# EAGLE design basic (EAGLE 7.5.0)
Luminous Flower Controller
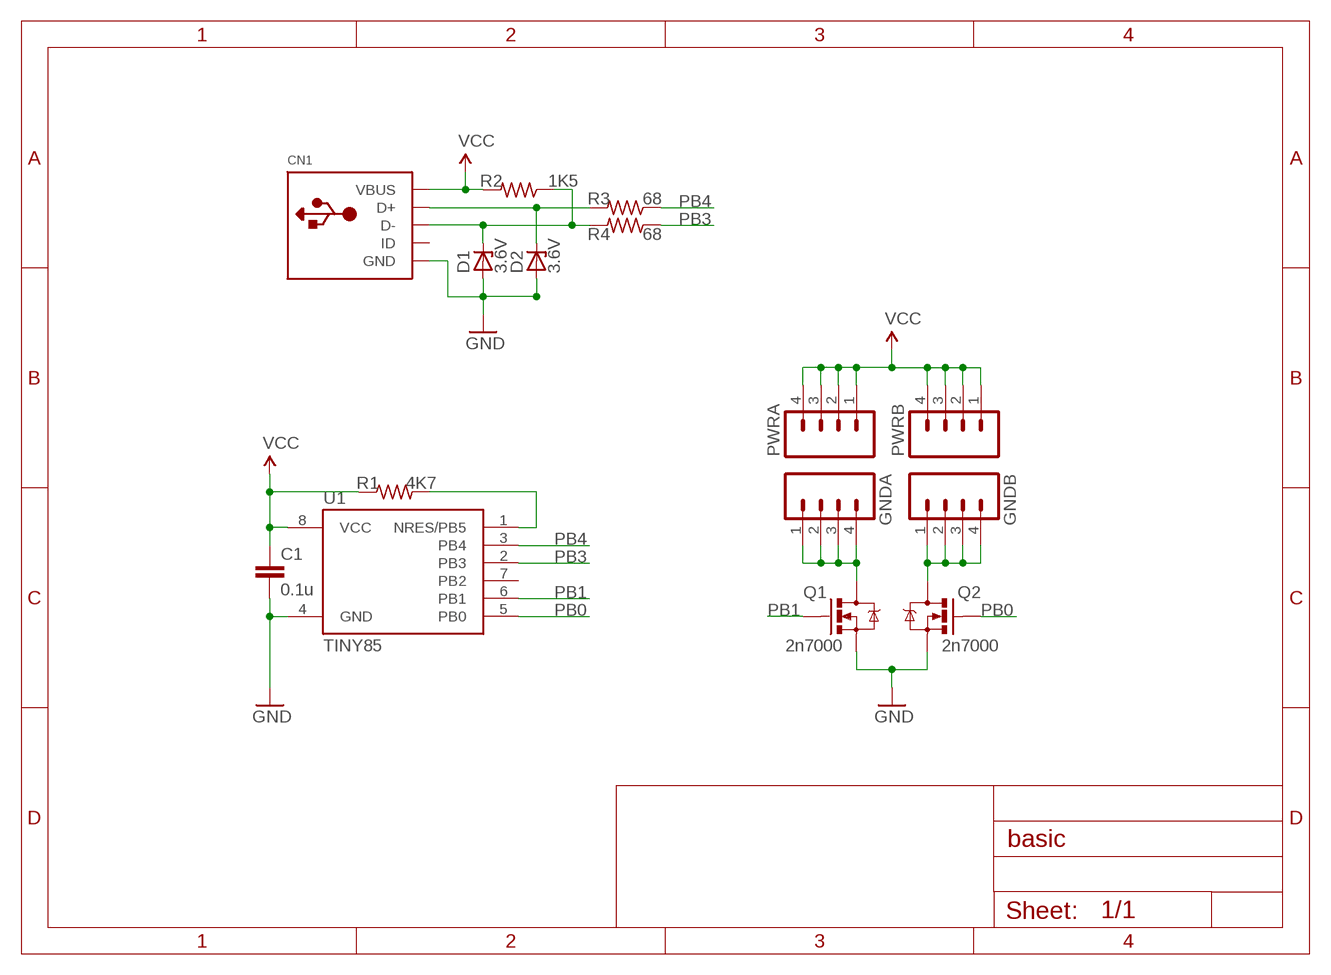
[diagram p0: schematic, sheet 1]

## Parts
C1  0.1u  C-EU025-024X044  [C025-024X044]
CN1  USBMOLEX  [USB-MINIB-THM-MOLEX]
D1  3.6V  ZENER-DIODEZD-5  [ZDIO-5]
D2  3.6V  ZENER-DIODEZD-5  [ZDIO-5]
GNDA  M041X04_NO_SILK  [1X04_NO_SILK]
GNDB  M041X04_NO_SILK  [1X04_NO_SILK]
PWRA  M041X04_NO_SILK  [1X04_NO_SILK]
PWRB  M041X04_NO_SILK  [1X04_NO_SILK]
Q1  2n7000  MOSFET-NCHANNEL2N7000  [TO-92]
Q2  2n7000  MOSFET-NCHANNEL2N7000  [TO-92]
R1  4K7  R-US_0204/2V  [0204V]
R2  1K5  R-US_0204/2V  [0204V]
R3  68  R-US_0204/2V  [0204V]
R4  68  R-US_0204/2V  [0204V]
U1  TINY85  ATTINY85-20P  [PDIP08_300MIL]

## Nets
D+: CN1.D+ D2.C R3.2
D-: CN1.D- D1.C R2.1 R4.2
GND: C1.2 CN1.GND D1.A D2.A Q1.1(S) Q2.1(S) U1.4(GND)
N$1: GNDA.1 GNDA.2 GNDA.3 GNDA.4 Q1.3(D)
N$3: R1.2 U1.1(NRES/PB5)
N$8: GNDB.1 GNDB.2 GNDB.3 GNDB.4 Q2.3(D)
PB0: Q2.2(G) U1.5(PB0)
PB1: Q1.2(G) U1.6(PB1)
PB3: R4.1 U1.2(PB3)
PB4: R3.1 U1.3(PB4)
VCC: C1.1 CN1.VBUS PWRA.1 PWRA.2 PWRA.3 PWRA.4 PWRB.1 PWRB.2 PWRB.3 PWRB.4 R1.1 R2.2 U1.8(VCC)
Unconnected: CN1.ID U1.7(PB2)

## Library data of the parts
C1 = rcl:C-EU: CAPACITOR, European symbol
CN1 = adafruit:USB: USB Connectors USBMINIB - Surface Mount Female Mini-B USB Connector 4UConnector: 06564 By microbuilder.eu Thru-hole RA Female Mini-B USB Connector 4UConnector: 18732 By ladyada.net
D1 D2 = diode:ZENER-DIODE: Z-Diode
GNDA GNDB PWRA PWRB = SparkFun-Connectors:M04: Header 4 Standard 4-pin 0.1" header. Use with straight break away headers (SKU : PRT-00116), right angle break away headers (PRT-00553), swiss pins (PRT-00743), machine pins (PRT-00117), and female headers (PRT-00115). Molex polarized connector foot print use with SKU : PRT-08231 with associated crimp pins and housings. 1MM SMD Version SKU: PRT-10208
Q1 Q2 = SparkFun-DiscreteSemi:MOSFET-NCHANNEL: Common NMOSFET Parts MFG P/N Store ID Prod ID FDD8780 TRANS-09984 SI7820DN TRANS-11055 FDS6630A IC-08089 2N7002PW TRANS-11151 FQP30N06L COM-10213 TRANS-10060 BSS123LT1G TRANS-08345 BSS138 TRANS-00830 BS170 2N7000
R1-R4 = resistor:R-US_: RESISTOR, American symbol
U1 = _hhn_attiny25_45_85:ATTINY85*: ATMEL ATtiny 85 Packages: P = PDIP 08 30mil S = SOIC 08 EIAJ 208mil Technologies Note: for complete ordering code (temp. range, finish, tape&reel etc.) see www.atmel.com • Supply Voltage: V = (1.8…5.5)V | [blank] = (2.7…5.5)V • Speed: 10 = 10 MHz | 20 = 20 MHz Author: Dipl.-Ing. FH Rainer Bayer HHN Hochschule Heilbronn (Heilbronn University), rainer.bayer@hs-heilbronn.de Ingenieurbüro ing-rb, mail@ing-rb.de

## Board
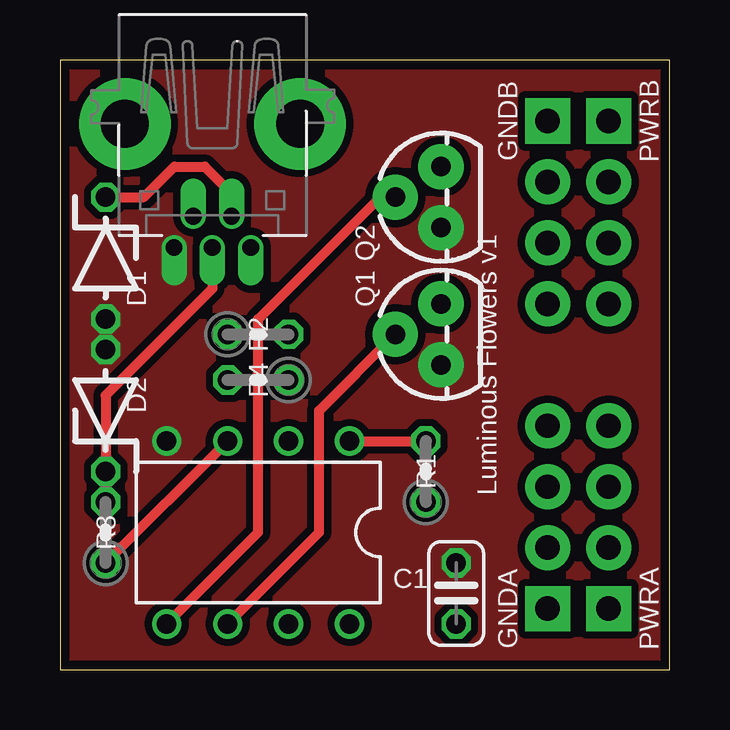
[diagram p1: board, top side]
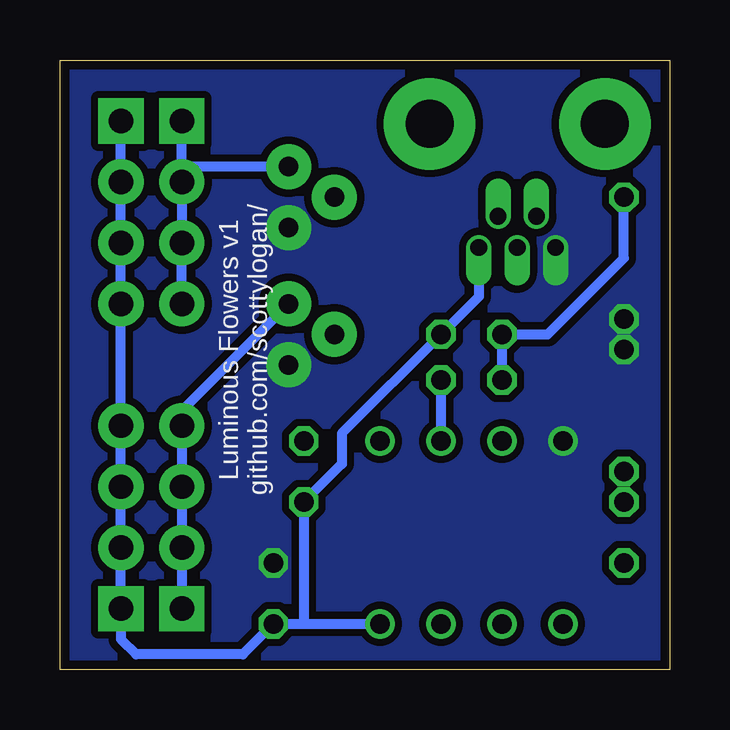
[diagram p2: board, bottom side, seen from below]

Size 25.4 x 25.4 mm. Coordinates in mm from the lower left corner, seen from the top.
Outline: 0,0 25.4,0 25.4,25.4 0,25.4 0,0
Copper layers (1*16): Top 0.0356mm / dielectric 1.5011mm / Bottom 0.0356mm
Design rules "oshpark-2layer": minimum track width 6mil, minimum drill 13mil, track to track 6mil, track to pad 6mil, pad to pad 6mil, via to via 6mil, smd to smd 6mil, copper to edge 15mil, drill to drill 6mil, minimum pad ring 7mil, minimum via ring 7mil, stop-mask expansion 2.5mil, vias tented up to drill 0mil, thermal gap 10mil

### Footprints (pad centres in the part's own frame; a part is rotated, then mirrored left to right if it is on the bottom)
C025-024X044 = drill 0.813 octagon: 1 -1.27,0; 2 1.27,0
USB-MINIB-THM-MOLEX = drill 0.7 offset: D+ 0,9.72; D- -0.8,8.42; GND 1.6,9.72; ID 0.8,8.42; VBUS -1.6,9.72 | drill 2 pad 3.81: GND1 -3.65,4.57; GND4 3.65,4.57
ZDIO-5 = drill 0.813 octagon: A 2.54,0; C -2.54,0
1X04_NO_SILK = drill 1.016 pad 1.88 square: 1 0,0 | drill 1.016 pad 1.88: 2 2.54,0; 3 5.08,0; 4 7.62,0
TO-92 = drill 0.813 pad 1.88: 1 -1.27,0; 2 0,1.905; 3 1.27,0
0204V = drill 0.813 octagon: 1 -1.27,0; 2 1.27,0
PDIP08_300MIL = drill 0.813: 1 -3.81,-3.81; 2 -1.27,-3.81; 3 1.27,-3.81; 4 3.81,-3.81; 5 3.81,3.81; 6 1.27,3.81; 7 -1.27,3.81; 8 -3.81,3.81

### Placement (x,y rotation side)
C1  16.51,3.17 90 top
CN1  6.35,27.3 180 top
D1  1.91,17.14 270 top
D2  1.91,10.79 90 top
GNDA  20.32,2.54 90 top
GNDB  20.32,22.86 270 top
PWRA  22.86,2.54 90 top
PWRB  22.86,22.86 270 top
Q1  15.88,13.97 90 top
Q2  15.88,19.68 90 top
R1  15.24,8.26 90 top
R2  8.26,13.97 0 top
R3  1.91,5.71 90 top
R4  8.26,12.06 180 top
U1  8.26,5.71 180 top

### Tracks (layer width: path | path; a pad name or v marks a point on that pad's centre or on a via)
D+
  Top 0.406: CN1.D+ 6.35,15.88 1.91,11.43 D2.C R3.2
D-
  Top 0.406: D1.C 3.49,19.68 4.76,20.95 6.03,20.95 6.99,20 6.99,19.05 CN1.D-
  Bottom 0.406: R4.2 R2.1 5.08,13.97 1.91,17.14 D1.C
GND
  pour Bottom (isolate 0.305, no thermals): 0,0 25.4,0 25.4,25.4 0,25.4
  pour Top (isolate 0.305, no thermals): 0,0 25.4,0 25.4,25.4 0,25.4
N$1
  Bottom 0.406: Q1.3 20.32,10.79 GNDA.4 GNDA.3 GNDA.2 GNDA.1
N$3
  Top 0.406: U1.1 R1.2
N$8
  Bottom 0.406: Q2.3 20.32,20.95 | 20.32,20.95 GNDB.1 | 20.32,20.95 GNDB.2 GNDB.3 GNDB.4
PB0
  Top 0.406: U1.5 8.26,5.71 8.26,14.61 13.34,19.68 Q2.2
PB1
  Top 0.406: U1.6 10.79,5.71 10.79,10.79 Q1.2
PB3
  Bottom 0.406: U1.2 R4.1
PB4
  Top 0.406: R3.1 U1.3
VCC
  Bottom 0.406: 15.24,1.91 C1.1 17.78,0.64 22.23,0.64 22.86,1.27 PWRA.1 PWRA.2 PWRA.3 PWRA.4 PWRB.4 PWRB.3 PWRB.2 PWRB.1 | 15.24,1.91 U1.8 | 15.24,1.91 R1.1 13.65,8.57 13.65,9.84 R2.2 7.95,15.54 CN1.VBUS

### Text on the board
tPlace: Luminous Flowers v1
bPlace: Luminous Flowers v1 / github.com/scottylogan/